# EAGLE design VCNL4040 (EAGLE 7.7.0)
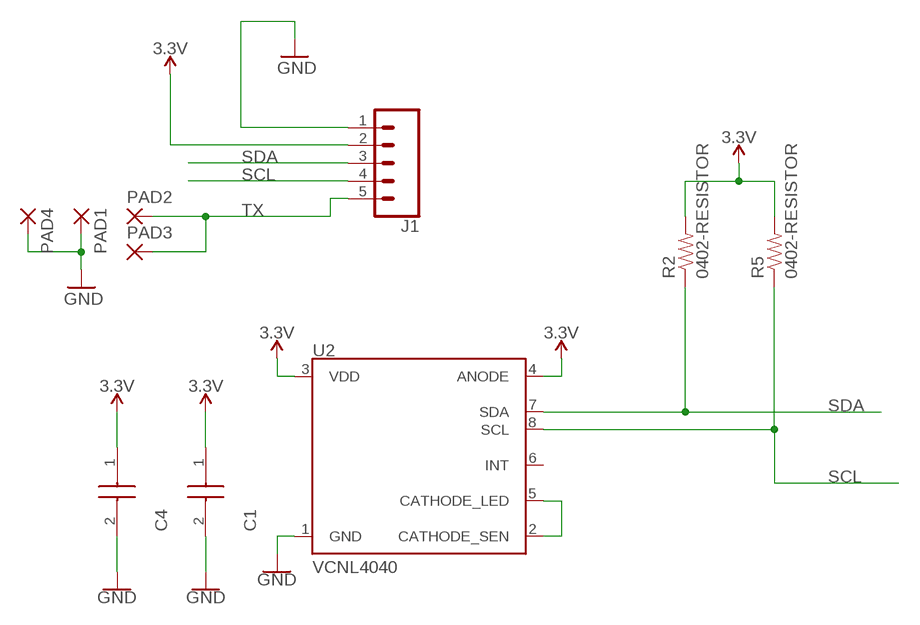
[diagram p0: schematic, sheet 1]

## Parts
C1  0402-CAPCAPACITOR-0402  [CAPC1005X56N]
C4  0402-CAPCAPACITOR-0402  [CAPC1005X56N]
J1  CONN_051.27MM  [1X05_1.27MM]
PAD1  SMD2  [SMD1,27-2,54]
PAD2  SMD2  [SMD1,27-2,54]
PAD3  SMD2  [SMD1,27-2,54]
PAD4  SMD2  [SMD1,27-2,54]
R2  0402-RESISTOR  RES_0402  [0402]
R5  0402-RESISTOR  RES_0402  [0402]
U2  VCNL4040  [SPARKX_VCNL4040]

## Nets
3.3V: C1.1 C4.1 J1.2 R2.2 R5.2 U2.3(VDD) U2.4(ANODE)
GND: C1.2 C4.2 J1.1 PAD1.1(P) PAD4.1(P) U2.1(GND)
N$6: U2.2(CATHODE_SEN) U2.5(CATHODE_LED)
SCL: J1.4 R5.1 U2.8(SCL)
SDA: J1.3 R2.1 U2.7(SDA)
TX: J1.5 PAD2.1(P) PAD3.1(P)
Unconnected: U2.6(INT)

## Library data of the parts
C1 C4 = CJz_Master_Eaglez_Library:0402-CAP: Multilayer Ceramic Capacitors MLCC - SMD/SMT 6.3V 1uF X7R 0402 10% Tol Source: Datasheet; DESCRIPTION: Multilayer Ceramic Capacitors MLCC - SMD/SMT 6.3V 1uF X7R 0402 10% Tol; HEIGHT: 0.56mm; MANUFACTURER_NAME: AVX; MANUFACTURER_PART_NUMBER: 04026C105KAT2A; MOUSER_PART_NUMBER: 581-04026C105KAT2A; MOUSER_PRICE-STOCK: https://www.mouser.co.uk/ProductDetail/AVX/04026C105KAT2A?qs=vNaUhps%252BC9%252B%252BBkS0SDtwiQ%3D%3D
J1 = MCXI_master_lib:CONN_05: Multi connection point. Often used as Generic Header-pin footprint for 0.1 inch spaced/style header connections On any of the 0.1 inch spaced packages, you can populate with these: Break Away Headers - Straight <https://www.sparkfun.com/products/116> (PRT-00116) Break Away Male Headers - Right Angle <https://www.sparkfun.com/products/553> (PRT-00553) Female Headers <https://www.sparkfun.com/products/115> (PRT-00115) Break Away Headers - Machine Pin <https://www.sparkfun.com/products/117> (PRT-00117) Break Away Female Headers - Swiss Machine Pin <https://www.sparkfun.com/products/743> (PRT-00743) For SCREWTERMINALS and SPRING TERMINALS visit here: Screw Terimnals on SparkFun.com <https://www.sparkfun.com/search/results?term=Screw+Terminals> (5mm/3.5mm/2.54mm spacing) This device is also useful as a general connection point to wire up your design to another part of your project. Our various solder wires solder well into these plated through hole pads. Hook-Up Wire - Assortment (Stranded, 22 AWG) <https://www.sparkfun.com/products/11375> (PRT-11375) Hook-Up Wire - Assortment (Solid Core, 22 AWG) <https://www.sparkfun.com/products/11367> (PRT-11367) View the entire wire category on our website here <https://www.sparkfun.com/categories/141> Special notes: Molex polarized connector foot print use with SKU : PRT-08231 with associated crimp pins and housings. 1MM SMD Version SKU: PRT-10208
PAD1-PAD4 = CJz_Master_Eaglez_Library:SMD2: SMD PAD
R2 R5 = Perfect_0402:RES_0402: 0402 (1005 Metric) Nick Garner - TeleSense
U2 = SparkFun-Sensors:VCNL4040: Vishay VCNL4040 Human Presence sensor A presence sensor with a range of 20 cm. VCNL4040 integrates a proximity sensor (PS), ambient light sensor (ALS), and a high power IRED into one small package.; PROD_ID: IC-14227

## Net classes
1 power: width 0.203 mm

## Board
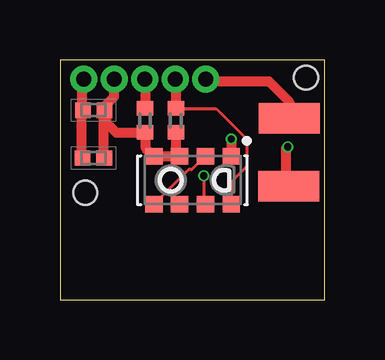
[diagram p1: board, top side]
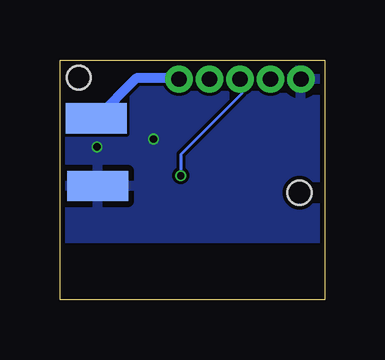
[diagram p2: board, bottom side, seen from below]

Size 11.03 x 10.01 mm. Coordinates in mm from the lower left corner, seen from the top.
Outline: 0,0.01 11.03,0 11.03,10.01 0,10.01 0,0.01
Copper layers (1*16): Top 0.035mm / dielectric 1.6mm / Bottom 0.035mm
Design rules "jlcpcb-2layers": minimum track width 5mil, minimum drill 0.3mm, track to track 5mil, track to pad 5mil, pad to pad 5mil, via to via 5mil, smd to smd 5mil, copper to edge 0.2mm, drill to drill 6mil, minimum pad ring 10mil, minimum via ring 3mil, stop-mask expansion 4mil, vias tented up to drill 0mil, thermal gap 10mil
Holes 1 mm at 1.05,4.47 10.25,9.27

### Footprints (pad centres in the part's own frame; a part is rotated, then mirrored left to right if it is on the bottom)
CAPC1005X56N = smd 0.65 x 0.64: 1 -0.45,0; 2 0.45,0
1X05_1.27MM = drill 0.63 pad 1: 1 0,0; 2 1.27,0; 3 2.54,0; 4 3.81,0; 5 5.08,0
SMD1,27-2,54 = smd 1.27 x 2.54: 1 0,0
0402 = smd 0.6 x 0.7: 1 -0.5,0; 2 0.5,0
SPARKX_VCNL4040 = smd 0.7 x 0.725: 1 1,-1.613; 2 1,-0.537; 3 1,0.537; 4 1,1.613; 5 -1,1.613; 6 -1,0.537; 7 -1,-0.537; 8 -1,-1.613

### Placement (x,y rotation side)
C1  1.39,5.92 180 top
C4  1.4,7.91 180 top
J1  0.99,9.21 0 top
PAD1  9.54,4.74 90 top
PAD2  9.52,7.57 90 bottom
PAD3  9.55,7.57 270 top
PAD4  9.46,4.75 270 bottom
R2  3.54,7.49 270 top
R5  4.83,7.48 270 top
U2  5.52,4.99 90 top

### Tracks (layer width: path | path; a pad name or v marks a point on that pad's centre or on a via)
3.3V
  Top 0.127: 4.85,6.96 R5.2 | 3.58,6.96 R2.2 3.45,7.08 | 3.84,6.07 U2.4 3.96,6.07 4.09,5.99 | 1.8,5.94 C1.1 | 1.8,7.85 C4.1 1.93,7.97 | 4.98,6.07 4.85,6.2 U2.3 4.98,6.07
  Top 0.406: 1.8,7.85 1.8,5.96 C1.1 | J1.2 2.25,8.47 1.93,8.15 1.93,7.97 1.93,7.39 2.35,6.97 3.53,6.97 R2.2 3.58,6.95 3.58,6.32 3.84,6.07 | 4.09,5.99 4.78,5.99 U2.3 | 4.85,6.2 4.85,6.96 R5.2
GND  (via drill 0.3)
  Top 0.127: 0.91,5.94 C1.2 | 0.91,7.85 C4.2 0.91,7.97 | 7.14,6.07 U2.1 | 9.42,4.8 PAD1.1 | 0.91,9.12 J1.1
  Top 0.406: 0.91,5.94 0.91,7.87 C4.2 0.91,7.95 0.91,9.12 | v7.14,6.7 U2.1 | 9.42,4.8 9.42,6.32 v9.49,6.38
  pour Bottom: -1.15,10.67 -1.15,2.57 11.75,2.57 11.75,10.67
N$6
  Top 0.127: U2.5 3.96,4.04 5.36,5.43 5.49,5.43 5.99,5.94 U2.2
SCL
  Top 0.127: 4.85,8.1 R5.1 4.85,7.97 6.5,7.97 7.77,6.7 7.77,5.56 7.14,4.93 7.14,4.04 U2.8 | 4.85,9.12 J1.4
  Top 0.406: 4.85,8.1 4.85,9.16 J1.4
SDA  (via drill 0.3)
  Top 0.127: 3.58,8.1 R2.1 | 3.58,9.12 J1.3 | v5.99,5.18 5.99,4.04 U2.7
  Top 0.406: 3.58,8.1 3.58,9.16 J1.3
  Bottom 0.127: v5.99,5.18 5.99,6.07 3.45,8.61 3.45,9.12 J1.3
TX
  Top 0.127: 6.12,9.12 J1.5 | 9.55,7.59 PAD3.1
  Top 0.406: 6.12,9.12 8.7,9.12 9.55,8.27 PAD3.1
  Bottom 0.127: 9.42,7.59 PAD2.1 | 6.12,9.24 J1.5
  Bottom 0.406: 6.12,9.24 7.85,9.24 PAD2.1